# EAGLE schematic SlidingTargetUnit (EAGLE 9.6.2)
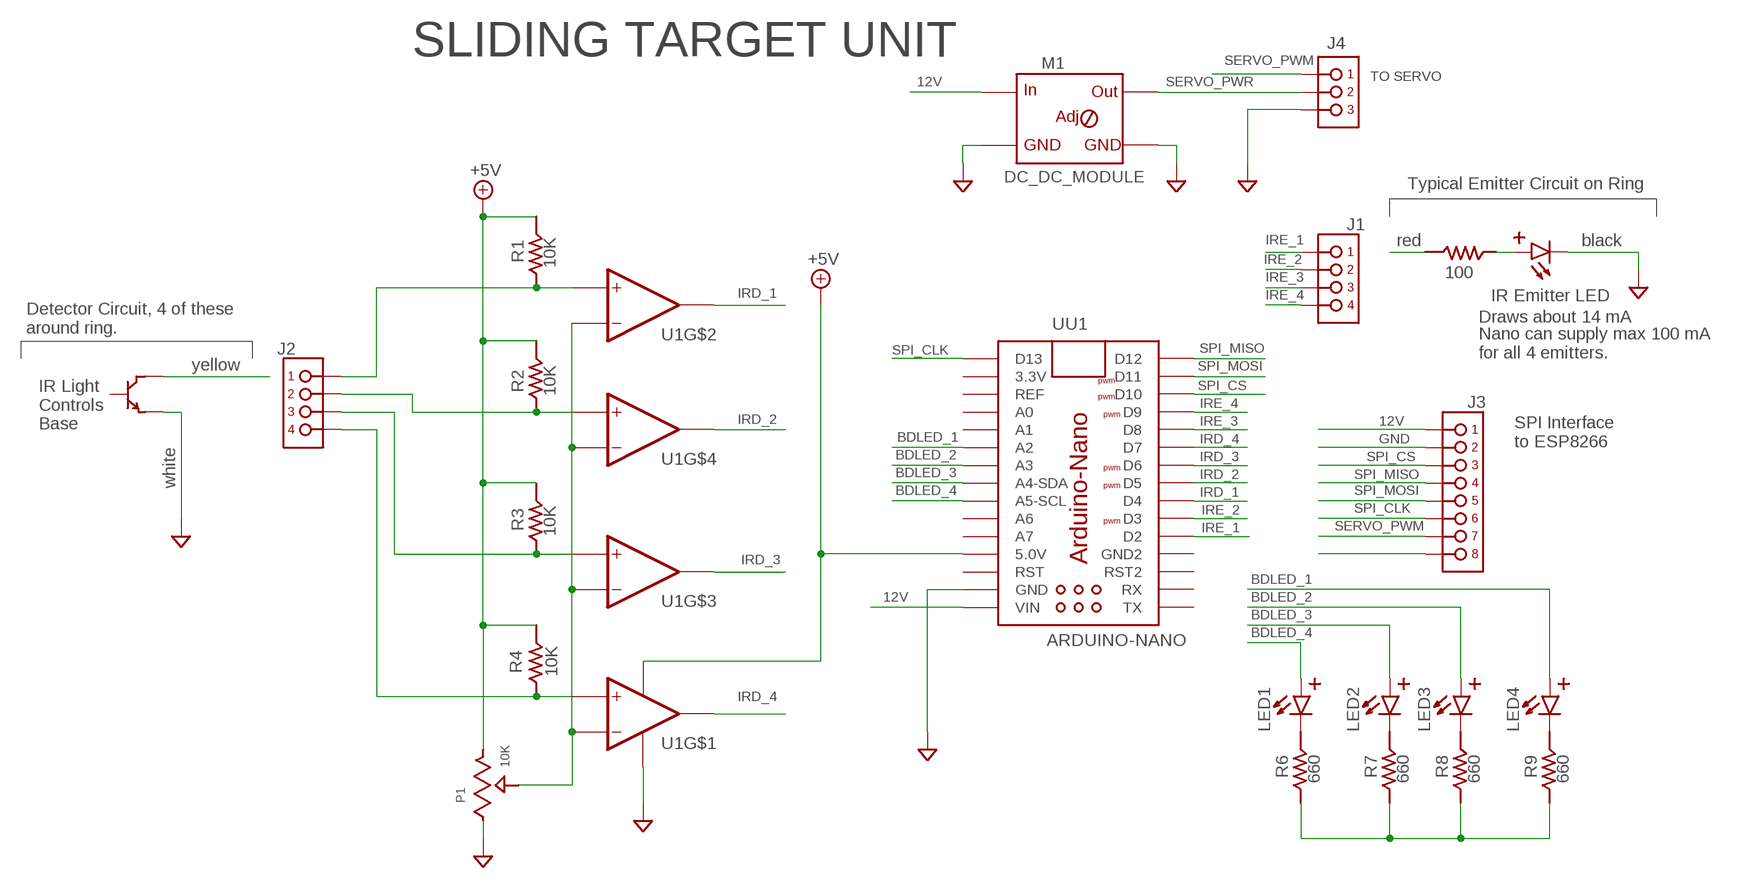
[diagram p0: schematic, sheet 1]

## Parts
J1  PINHDR_1X4TH_VERT_100  [PINHDR_TH_100_1X4]
J2  PINHDR_1X4TH_VERT_100  [PINHDR_TH_100_1X4]
J3  PINHDR_1X8-PH1  [PHOENIX_TH_SIDE_200_1X8]
J4  PINHDR_1X3-100  [PINHDR_TH_100_1X3]
LED1  LED1206  [LED_1206]
LED2  LED1206  [LED_1206]
LED3  LED1206  [LED_1206]
LED4  LED1206  [LED_1206]
LED5  IR Emitter LED  LED1206  [LED_1206]
M1  DC_DC_MODULE  [DC_DC_MODULE]
P1  10K  TRIMPOTSIP  [TRIMPOT_SIP_100]
R1  10K  R1206(3216METRIC)  [R1206]
R2  10K  R1206(3216METRIC)  [R1206]
R3  10K  R1206(3216METRIC)  [R1206]
R4  10K  R1206(3216METRIC)  [R1206]
R5  100  R1206(3216METRIC)  [R1206]
R6  660  R1206(3216METRIC)  [R1206]
R7  660  R1206(3216METRIC)  [R1206]
R8  660  R1206(3216METRIC)  [R1206]
R9  660  R1206(3216METRIC)  [R1206]
T1  T_NPN  [TO-92]
U1  LM2902  [SO16LNB-14PIN]
UU1  ARDUINO-NANO  [ARDUINO-NANO]

## Nets
12V: J3.P$1 M1.IN+(IN) UU1.VIN
+5V: P1.P$3 R1.P$2 R2.P$2 R3.P$2 R4.P$2 U1.P$4(P+) UU1.5V(5.0V)
BDLED_1: LED4.ANODE(+)(ANODE) UU1.A2
BDLED_2: LED3.ANODE(+)(ANODE) UU1.A3
BDLED_3: LED2.ANODE(+)(ANODE) UU1.A4(A4-SDA)
BDLED_4: LED1.ANODE(+)(ANODE) UU1.A5(A5-SCL)
GND: J3.P$2 J4.3 LED5.CATHODE(-)(CATHODE) M1.IN-(G1) M1.OUT-(G2) P1.P$1 T1.P$3(EMITTER) U1.P$11(P-) UU1.GND
IRD_1: U1.P$7(OUT) UU1.D4
IRD_2: U1.P$14(OUT) UU1.D5
IRD_3: U1.P$8(OUT) UU1.D6
IRD_4: U1.P$1(OUT) UU1.D7
IRE_1: J1.1 UU1.D2
IRE_2: J1.2 UU1.D3
IRE_3: J1.3 UU1.D8
IRE_4: J1.4 UU1.D9
N$4: J3.P$8
N$5: J2.1 R1.P$1 U1.P$5(+IN)
N$6: J2.2 R2.P$1 U1.P$12(+IN)
N$7: J2.3 R3.P$1 U1.P$10(+IN)
N$8: J2.4 R4.P$1 U1.P$3(+IN)
N$9: R5.P$2
N$10: LED5.ANODE(+)(ANODE) R5.P$1
N$11: P1.P$2 U1.P$2(-IN) U1.P$6(-IN) U1.P$9(-IN) U1.P$13(-IN)
N$12: LED1.CATHODE(-)(CATHODE) R6.P$2
N$13: T1.P$1(COLLECTOR)
N$14: LED2.CATHODE(-)(CATHODE) R7.P$2
N$15: LED3.CATHODE(-)(CATHODE) R8.P$2
N$16: LED4.CATHODE(-)(CATHODE) R9.P$2
N$17: R6.P$1 R7.P$1 R8.P$1 R9.P$1
SERVO_PWM: J3.P$7 J4.1
SERVO_PWR: J4.2 M1.OUT+(OUT)
SPI_CLK: J3.P$6 UU1.D13
SPI_CS: J3.P$3 UU1.D10
SPI_MISO: J3.P$4 UU1.D12
SPI_MOSI: J3.P$5 UU1.D11
Unconnected: T1.P$2(BASE) UU1.3.3(3.3V) UU1.A0 UU1.A1 UU1.A6 UU1.A7 UU1.GND2 UU1.REF UU1.RST UU1.RST2 UU1.RX UU1.TX

## Notes on the sheet
- SLIDING TARGET UNIT
- TO SERVO
- Typical Emitter Circuit on Ring
- red | black
- Draws about 14 mA
- Detector Circuit, 4 of these
  around ring.
- Nano can supply max 100 mA
  for all 4 emitters.
- yellow
- IR Light 
  Controls 
  Base
- SPI Interface
  to ESP8266
- white

## Library data of the parts
J1 J2 = Dal_V2:PINHDR_1X4
J3 = Dal_V2:PINHDR_1X8
J4 = Dal_V2:PINHDR_1X3
LED1-LED5 = Dal_V2:LED: Standard LED
M1 = Dal_V2:DC_DC_MODULE
P1 = Dal_V2:TRIMPOT
R1-R9 = Dal_V2:R: Standard Resistor -- Various Sizes and Wattages
T1 = Dal_V2:T_NPN
U1 = Dal_V2:LM2902
UU1 = Dal_V2:ARDUINO-NANO